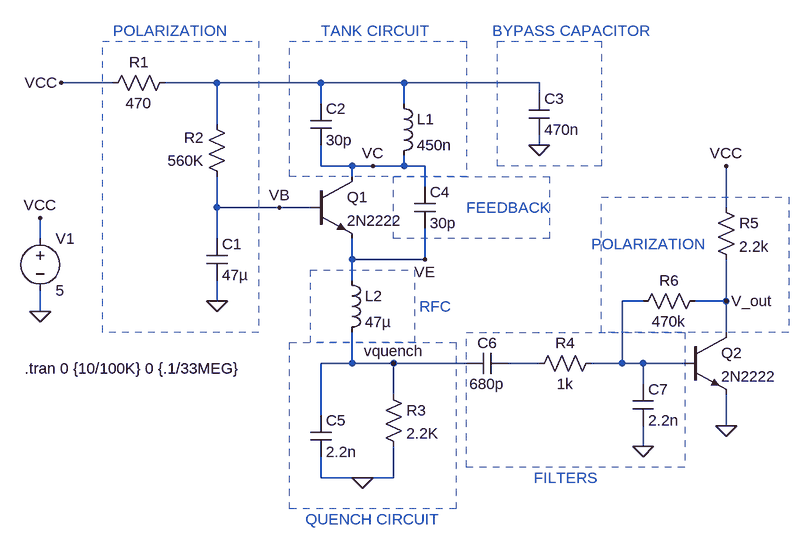
[diagram p0: schematic SUPER-REGEN-FINAL.asc]
SUPER-REGEN-FINAL.asc, the LTspice schematic file:
Version 4
SHEET 1 980 680
WIRE -64 -64 -144 -64
WIRE 96 -64 16 -64
WIRE 256 -64 96 -64
WIRE 384 -64 256 -64
WIRE 592 -64 384 -64
WIRE 592 -48 592 -64
WIRE 256 -32 256 -64
WIRE 384 -32 384 -64
WIRE 96 0 96 -64
WIRE 592 32 592 16
WIRE 256 64 256 32
WIRE 304 64 256 64
WIRE 336 64 304 64
WIRE 384 64 384 48
WIRE 384 64 336 64
WIRE 416 64 384 64
WIRE 304 80 304 64
WIRE 416 96 416 64
WIRE 96 128 96 80
WIRE 192 128 96 128
WIRE 240 128 192 128
WIRE 880 128 880 64
WIRE -176 176 -176 144
WIRE 96 176 96 128
WIRE 304 208 304 176
WIRE 416 208 416 160
WIRE 416 208 304 208
WIRE 304 240 304 208
WIRE 96 272 96 240
WIRE 752 272 720 272
WIRE 880 272 880 208
WIRE 880 272 832 272
WIRE -176 288 -176 256
WIRE 880 320 880 272
WIRE 304 368 304 320
WIRE 304 368 256 368
WIRE 368 368 304 368
WIRE 480 368 368 368
WIRE 592 368 544 368
WIRE 720 368 720 272
WIRE 720 368 672 368
WIRE 752 368 720 368
WIRE 816 368 752 368
WIRE 752 400 752 368
WIRE 368 416 368 368
WIRE 256 448 256 368
WIRE 880 464 880 416
WIRE 752 496 752 464
WIRE 256 544 256 512
WIRE 320 544 256 544
WIRE 368 544 368 496
WIRE 368 544 320 544
FLAG 592 32 0
FLAG 320 544 0
FLAG -176 288 0
FLAG -176 144 VCC
FLAG -144 -64 VCC
FLAG 96 272 0
FLAG 368 368 vquench
FLAG 416 208 VE
FLAG 192 128 VB
FLAG 336 64 VC
FLAG 880 464 0
FLAG 752 496 0
FLAG 880 64 VCC
FLAG 880 272 V_out
SYMBOL cap 80 176 R0
SYMATTR InstName C1
SYMATTR Value 47µ
SYMBOL res 32 -80 R90
WINDOW 0 0 56 VBottom 2
WINDOW 3 32 56 VTop 2
SYMATTR InstName R1
SYMATTR Value 470
SYMBOL res 112 96 R180
WINDOW 0 36 76 Left 2
WINDOW 3 36 40 Left 2
SYMATTR InstName R2
SYMATTR Value 560K
SYMBOL npn 240 80 R0
SYMATTR InstName Q1
SYMATTR Value 2N2222
SYMBOL ind 368 -48 R0
SYMATTR InstName L1
SYMATTR Value 450n
SYMBOL cap 240 -32 R0
SYMATTR InstName C2
SYMATTR Value 30p
SYMBOL cap 576 -48 R0
SYMATTR InstName C3
SYMATTR Value 470n
SYMBOL cap 400 96 R0
SYMATTR InstName C4
SYMATTR Value 30p
SYMBOL ind 288 224 R0
SYMATTR InstName L2
SYMATTR Value 47µ
SYMBOL cap 240 448 R0
SYMATTR InstName C5
SYMATTR Value 2.2n
SYMBOL res 352 400 R0
SYMATTR InstName R3
SYMATTR Value 2.2K
SYMBOL voltage -176 160 R0
WINDOW 123 0 0 Left 0
WINDOW 39 0 0 Left 0
SYMATTR InstName V1
SYMATTR Value 5
SYMBOL cap 544 352 R90
WINDOW 0 0 32 VBottom 2
WINDOW 3 32 32 VTop 2
SYMATTR InstName C6
SYMATTR Value 680p
SYMBOL res 688 352 R90
WINDOW 0 0 56 VBottom 2
WINDOW 3 32 56 VTop 2
SYMATTR InstName R4
SYMATTR Value 1k
SYMBOL cap 736 400 R0
SYMATTR InstName C7
SYMATTR Value 2.2n
SYMBOL npn 816 320 R0
SYMATTR InstName Q2
SYMATTR Value 2N2222
SYMBOL res 864 112 R0
SYMATTR InstName R5
SYMATTR Value 2.2k
SYMBOL res 848 256 R90
WINDOW 0 0 56 VBottom 2
WINDOW 3 32 56 VTop 2
SYMATTR InstName R6
SYMATTR Value 470k
TEXT -200 376 Left 2 !.tran 0 {10/100K} 0 {.1/33MEG}
TEXT 480 128 Left 2 ;FEEDBACK
TEXT 672 184 Left 2 ;POLARIZATION
TEXT -64 -144 Left 2 ;POLARIZATION
TEXT 584 544 Left 2 ;FILTERS
TEXT 232 608 Left 2 ;QUENCH CIRCUIT
TEXT 408 280 Left 2 ;RFC
TEXT 256 -144 Left 2 ;TANK CIRCUIT
TEXT 520 -144 Left 2 ;BYPASS CAPACITOR
RECTANGLE Normal 160 320 -80 -128 2
RECTANGLE Normal 480 80 208 -128 2
RECTANGLE Normal 688 64 528 -128 2
RECTANGLE Normal 608 176 368 80 2
RECTANGLE Normal 400 336 240 224 2
RECTANGLE Normal 464 592 208 336 2
RECTANGLE Normal 816 528 480 320 2
RECTANGLE Normal 976 320 688 112 2

The netlist it stands for:
* SUPER-REGEN-FINAL.asc
C1 VB 0 47µ
R1 N001 VCC 470
R2 VB N001 560K
Q1 VC VB VE 0 2N2222
L1 N001 VC 450n
C2 N001 VC 30p
C3 N001 0 470n
C4 VC VE 30p
L2 VE vquench 47µ
C5 vquench 0 2.2n
R3 vquench 0 2.2K
V1 VCC 0 5
C6 N003 vquench 680p
R4 N002 N003 1k
C7 N002 0 2.2n
Q2 V_out N002 0 0 2N2222
R5 VCC V_out 2.2k
R6 V_out N002 470k
.model NPN NPN
.model PNP PNP
.lib standard.bjt
.tran 0 {10/100K} 0 {.1/33MEG}
* FEEDBACK
* POLARIZATION
* POLARIZATION
* FILTERS
* QUENCH CIRCUIT
* RFC
* TANK CIRCUIT
* BYPASS CAPACITOR
.backanno
.end